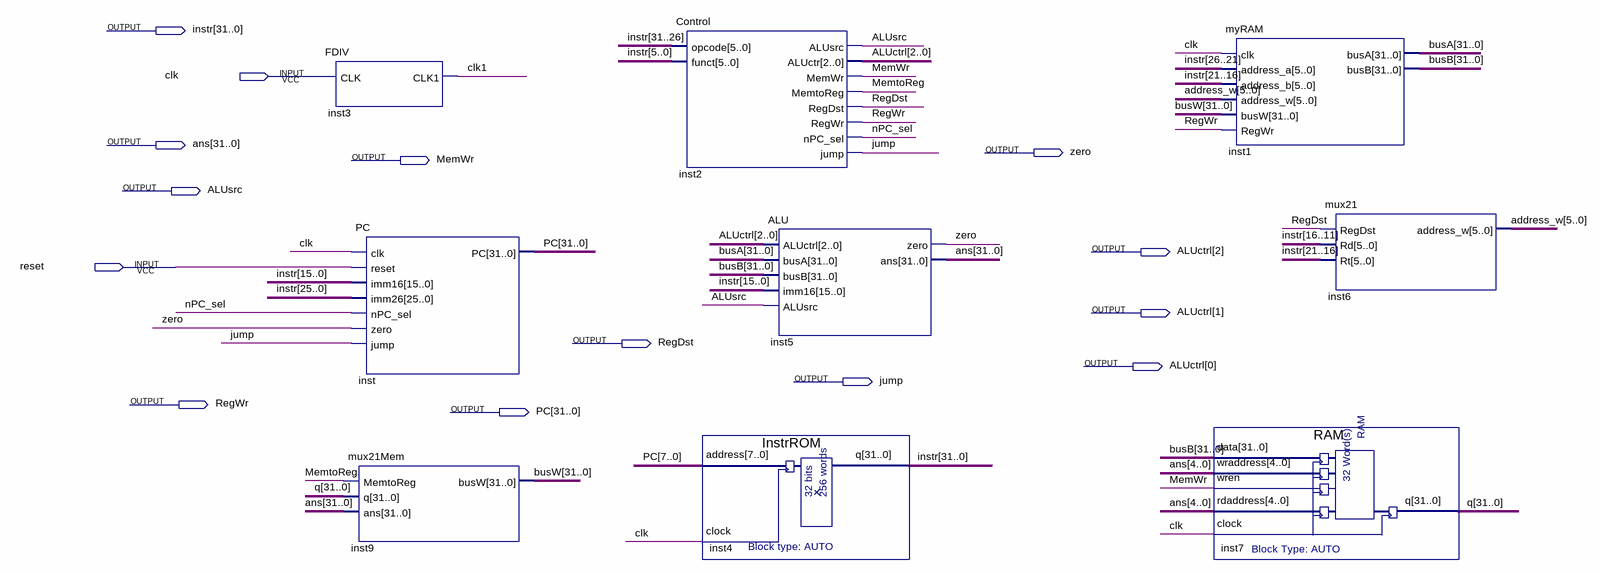
[diagram p0: schematic sheet]
// Quartus schematic CPU.bdf as structural Verilog: 9 symbols, 14 pins
module CPU (
  input  clk,
  input  reset,
  output [31:0] instr,
  output [31:0] ans,
  output zero,
  output MemWr,
  output ALUsrc,
  output [2:0] ALUctrl,
  output RegDst,
  output jump,
  output RegWr,
  output [31:0] PC
);

  wire clk1, MemtoReg, nPC_sel;
  wire [5:0] address_w;
  wire [31:0] busA, busB, busW, q;

  FDIV inst3 (.CLK(clk), .CLK1(clk1));
  PC inst (
    .clk(clk), .reset(reset), .imm16(instr[15:0]), .imm26(instr[25:0]), .nPC_sel(nPC_sel), .zero(zero),
    .jump(jump), .PC(PC));
  mux21Mem inst9 (.MemtoReg(MemtoReg), .q(q), .ans(ans), .busW(busW));
  Control inst2 (
    .opcode(instr[31:26]), .funct(instr[5:0]), .ALUsrc(ALUsrc), .ALUctr(ALUctrl), .MemWr(MemWr),
    .MemtoReg(MemtoReg), .RegDst(RegDst), .RegWr(RegWr), .nPC_sel(nPC_sel), .jump(jump));
  InstrROM inst4 (.address(PC[7:0]), .clock(clk), .q(instr));
  ALU inst5 (.ALUctrl(ALUctrl), .busA(busA), .busB(busB), .imm16(instr[15:0]), .ALUsrc(ALUsrc), .zero(zero), .ans(ans));
  myRAM inst1 (
    .clk(clk), .address_a(instr[26:21]), .address_b(instr[21:16]), .address_w(address_w), .busW(busW),
    .RegWr(RegWr), .busA(busA), .busB(busB));
  RAM inst7 (.data(busB), .wraddress(ans[4:0]), .wren(MemWr), .rdaddress(ans[4:0]), .clock(clk), .q(q));
  mux21 inst6 (.RegDst(RegDst), .Rd(instr[16:11]), .Rt(instr[21:16]), .address_w(address_w));
endmodule
